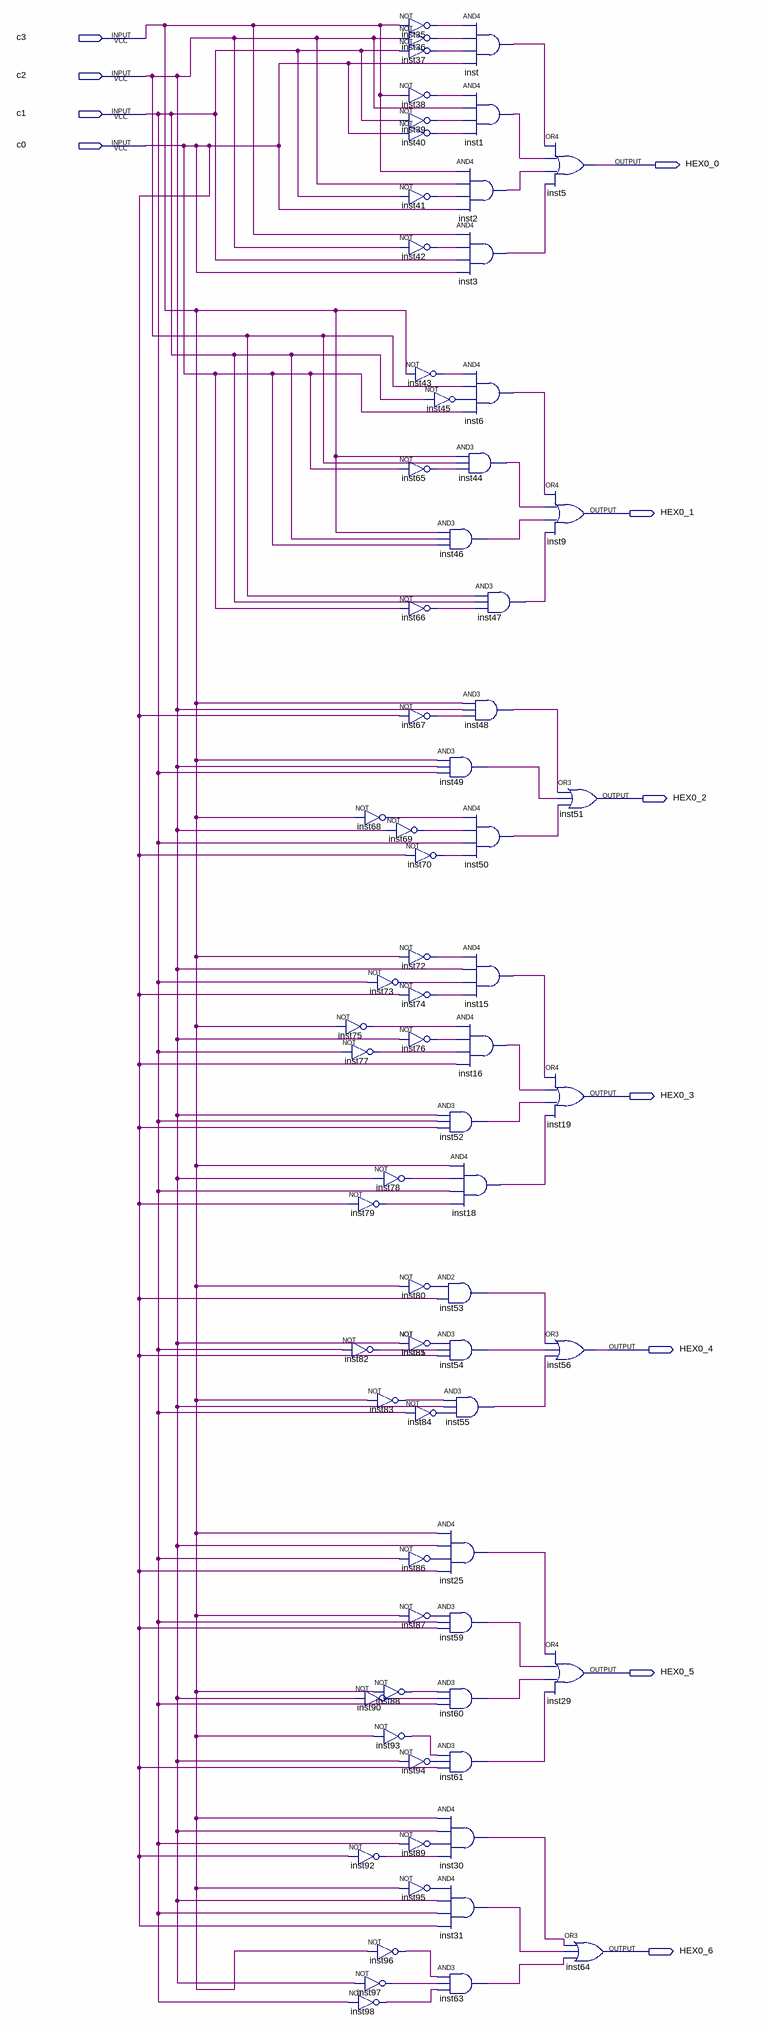
[diagram p0: schematic sheet]
// Quartus schematic HEXs.bdf as structural Verilog: 74 symbols, 11 pins
module HEXs (
  input  c3,
  input  c2,
  input  c1,
  input  c0,
  output HEX0_0,
  output HEX0_1,
  output HEX0_2,
  output HEX0_3,
  output HEX0_4,
  output HEX0_5,
  output HEX0_6
);

  wire inst1_out, inst2_out, inst3_out, inst6_out, inst15_out, inst16_out, inst18_out, inst25_out,
       inst30_out, inst31_out, inst35_out, inst36_out, inst37_out, inst38_out, inst39_out, inst40_out,
       inst41_out, inst42_out, inst43_out, inst44_out, inst45_out, inst46_out, inst47_out, inst48_out,
       inst49_out, inst50_out, inst52_out, inst53_out, inst54_out, inst55_out, inst59_out, inst60_out,
       inst61_out, inst63_out, inst65_out, inst66_out, inst67_out, inst68_out, inst69_out, inst70_out,
       inst72_out, inst73_out, inst74_out, inst75_out, inst76_out, inst77_out, inst78_out, inst79_out,
       inst80_out, inst81_out, inst82_out, inst83_out, inst84_out, inst86_out, inst87_out, inst88_out,
       inst89_out, inst90_out, inst92_out, inst93_out, inst94_out, inst95_out, inst96_out, inst97_out,
       inst98_out, inst_out;

  not inst75 (inst75_out, c3);
  not inst77 (inst77_out, c1);
  not inst82 (inst82_out, c1);
  not inst68 (inst68_out, c3);
  not inst69 (inst69_out, c2);
  not inst73 (inst73_out, c1);
  not inst78 (inst78_out, c2);
  not inst79 (inst79_out, c0);
  not inst83 (inst83_out, c3);
  not inst88 (inst88_out, c3);
  not inst90 (inst90_out, c2);
  not inst93 (inst93_out, c3);
  not inst92 (inst92_out, c0);
  not inst96 (inst96_out, c3);
  not inst97 (inst97_out, c2);
  not inst98 (inst98_out, c1);
  not inst35 (inst35_out, c3);
  not inst36 (inst36_out, c2);
  not inst37 (inst37_out, c1);
  not inst38 (inst38_out, c3);
  not inst39 (inst39_out, c1);
  not inst40 (inst40_out, c0);
  not inst41 (inst41_out, c1);
  not inst42 (inst42_out, c2);
  not inst43 (inst43_out, c3);
  not inst45 (inst45_out, c1);
  not inst65 (inst65_out, c0);
  and inst46 (inst46_out, c3, c1, c0);
  not inst66 (inst66_out, c0);
  not inst67 (inst67_out, c0);
  and inst49 (inst49_out, c3, c2, c1);
  not inst70 (inst70_out, c0);
  not inst72 (inst72_out, c3);
  not inst74 (inst74_out, c0);
  not inst76 (inst76_out, c2);
  and inst52 (inst52_out, c2, c1, c0);
  and inst53 (inst53_out, inst80_out, c0);
  not inst80 (inst80_out, c3);
  and inst54 (inst54_out, inst81_out, inst82_out, c0);
  not inst81 (inst81_out, c2);
  not inst85 (inst81_out, c2);
  and inst55 (inst55_out, inst83_out, c2, inst84_out);
  not inst84 (inst84_out, c1);
  and inst25 (inst25_out, c3, c2, inst86_out, c0);
  not inst86 (inst86_out, c1);
  and inst59 (inst59_out, inst87_out, c1, c0);
  not inst87 (inst87_out, c3);
  and inst60 (inst60_out, inst88_out, inst90_out, c1);
  and inst61 (inst61_out, inst93_out, inst94_out, c0);
  not inst94 (inst94_out, c2);
  and inst30 (inst30_out, c3, c2, inst89_out, inst92_out);
  not inst89 (inst89_out, c1);
  and inst31 (inst31_out, inst95_out, c2, c1, c0);
  not inst95 (inst95_out, c3);
  and inst63 (inst63_out, inst96_out, inst97_out, inst98_out);
  and inst (inst_out, inst35_out, inst36_out, inst37_out, c0);
  and inst1 (inst1_out, inst38_out, c2, inst39_out, inst40_out);
  and inst2 (inst2_out, c3, c2, inst41_out, c0);
  and inst3 (inst3_out, c3, inst42_out, c1, c0);
  and inst6 (inst6_out, inst43_out, c2, inst45_out, c0);
  and inst44 (inst44_out, c3, c2, inst65_out);
  and inst47 (inst47_out, c2, c1, inst66_out);
  and inst48 (inst48_out, c3, c2, inst67_out);
  and inst50 (inst50_out, inst68_out, inst69_out, c1, inst70_out);
  and inst15 (inst15_out, inst72_out, c2, inst73_out, inst74_out);
  and inst16 (inst16_out, inst75_out, inst76_out, inst77_out, c0);
  and inst18 (inst18_out, c3, inst78_out, c1, inst79_out);
  or inst5 (HEX0_0, inst_out, inst1_out, inst2_out, inst3_out);
  // OR4 inst9 has open pins: IN1=inst6_out, IN2=inst44_out, IN3=inst46_out, IN4=inst47_out, OUT=open
  // OR4 inst19 has open pins: IN1=inst15_out, IN2=inst16_out, IN3=inst52_out, IN4=inst18_out, OUT=open
  or inst56 (HEX0_4, inst53_out, inst54_out, inst55_out);
  // OR4 inst29 has open pins: IN1=inst25_out, IN2=inst59_out, IN3=inst60_out, IN4=inst61_out, OUT=open
  // OR3 inst51 has open pins: IN1=inst48_out, IN2=inst49_out, IN3=inst50_out, OUT=open
  // OR3 inst64 has open pins: IN1=inst30_out, IN2=inst31_out, IN3=inst63_out, OUT=open
endmodule
